# EAGLE design CPU_Dev_revB.2 (EAGLE 9.1.0)
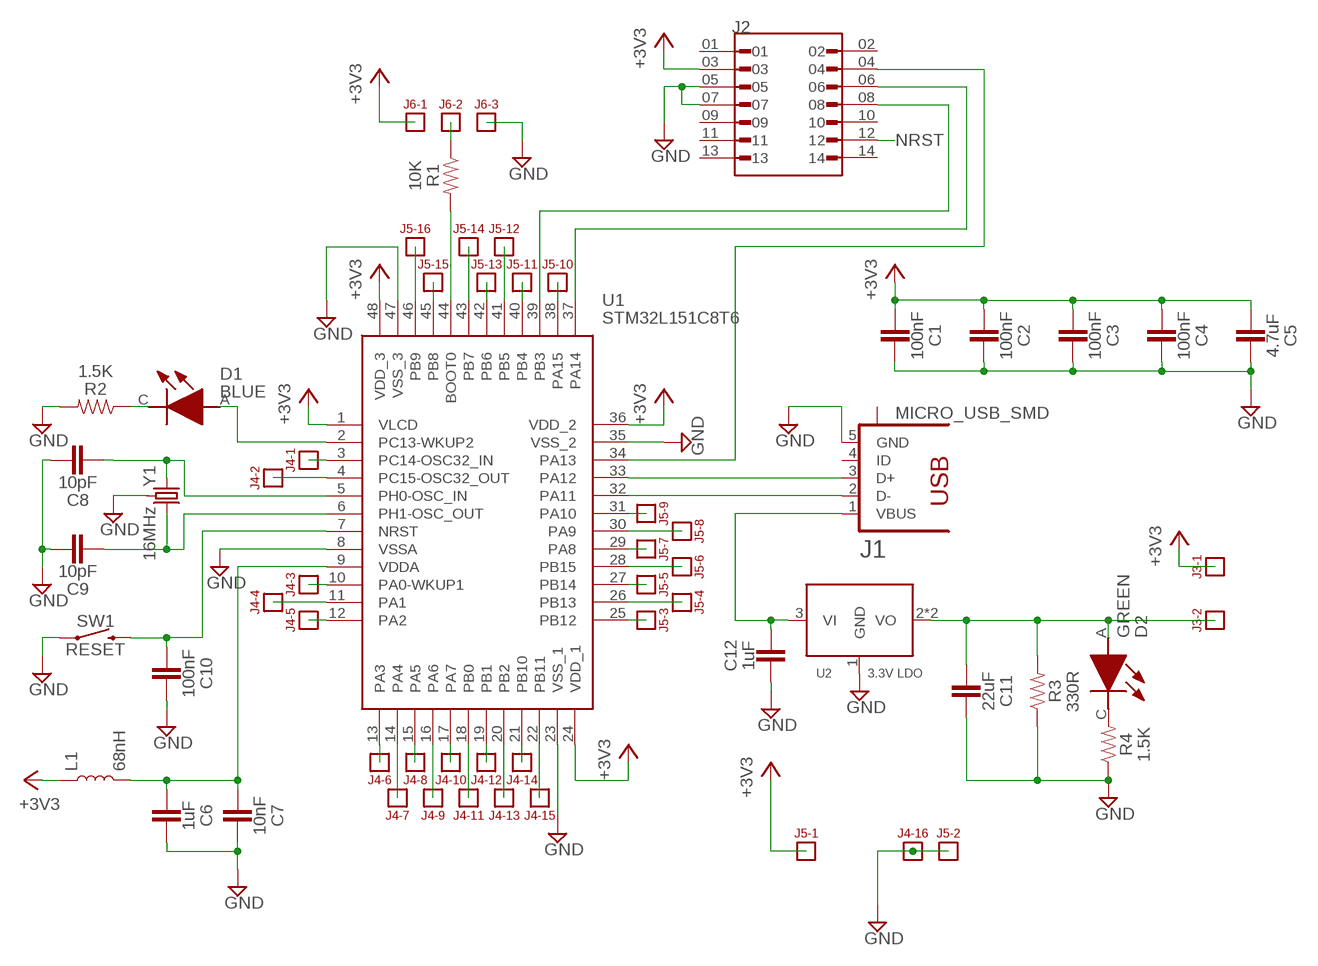
[diagram p0: schematic, sheet 1]

## Parts
C1  100nF  C_0402  [0402]
C2  100nF  C_0402  [0402]
C3  100nF  C_0402  [0402]
C4  100nF  C_0402  [0402]
C5  4.7uF  C_0402  [0402]
C6  1uF  C_0402  [0402]
C7  10nF  C_0402  [0402]
C8  10pF  C_0402  [0402]
C9  10pF  C_0402  [0402]
C10  100nF  C_0402  [0402]
C11  22uF  C_1206  [1206]
C12  1uF  C_0402  [0402]
D1  BLUE  LED_0603  [LED_0603]
D2  GREEN  LED_0603  [LED_0603]
J1  MICRO_USB_SMD  [10118192-0002LF]
J2  HEADER_DEBUG_SMD  [HEADER_DEBUG_SMD]
J3  HEADER_2PIN  [HEADER_2PIN]
J4  HEADER_16PIN  [HEADER_16PIN]
J5  HEADER_16PIN  [HEADER_16PIN]
J6  HEADER_3PIN  [HEADER_3PIN]
L1  68nH  L_0603  [0603]
R1  10K  R_0402  [0402]
R2  1.5K  R_0402  [0402]
R3  330R  R_0402  [0402]
R4  1.5K  R_0402  [0402]
SW1  RESET  PUSHBUTTON_SMD  [PUSHBUTTON_SMD]
U1  STM32L151C8T6  [LQFP-48_7X7]
U2  3.3V LDO  VREG_SOT223  [SOT223]
Y1  16MHz  XTAL_SMD3225-4P  [SMD3225-4P]

## Nets
+3V3: C1.1 C2.1 C3.1 C4.1 C5.1 J2.03 J3.P$1 J5.P$1 J6.P$1 L1.1 U1.1(VLCD) U1.24(VDD_1) U1.36(VDD_2) U1.48(VDD_3)
BOOT0: R1.2 U1.44(BOOT0)
GND: C1.2 C2.2 C3.2 C4.2 C5.2 C6.2 C7.2 C8.2 C9.2 C10.2 C11.2 C12.1 J1.5(GND) J2.05 J2.07 J4.P$16 J5.P$2 J6.P$3 R2.2 R3.1 R4.1 SW1.A1 SW1.B1 U1.8(VSSA) U1.23(VSS_1) U1.35(VSS_2) U1.47(VSS_3) U2.1(GND) Y1.2 Y1.4
N$1: C12.2 J1.1(VBUS) U2.3(VI)
N$2: C11.1 D2.A J3.P$2 R3.2 U2.2(VO) U2.4(VO)
N$4: D2.C(K) R4.2
N$8: D1.C(K) R2.1
N$9: J6.P$2 R1.1
NRST: C10.1 J2.12 SW1.C1 SW1.D1 U1.7(NRST)
PA0: J4.P$3 U1.10(PA0-WKUP1)
PA1: J4.P$4 U1.11(PA1)
PA2: J4.P$5 U1.12(PA2)
PA3: J4.P$6 U1.13(PA3)
PA4: J4.P$7 U1.14(PA4)
PA5: J4.P$8 U1.15(PA5)
PA6: J4.P$9 U1.16(PA6)
PA7: J4.P$10 U1.17(PA7)
PA8: J5.P$7 U1.29(PA8)
PA9: J5.P$8 U1.30(PA9)
PA10: J5.P$9 U1.31(PA10)
PA11: J1.2(D-) U1.32(PA11)
PA12: J1.3(D+) U1.33(PA12)
PA13: J2.04 U1.34(PA13)
PA14: J2.06 U1.37(PA14)
PA15: J5.P$10 U1.38(PA15)
PB0: J4.P$11 U1.18(PB0)
PB1: J4.P$12 U1.19(PB1)
PB2: J4.P$13 U1.20(PB2)
PB3: J2.08 U1.39(PB3)
PB4: J5.P$11 U1.40(PB4)
PB5: J5.P$12 U1.41(PB5)
PB6: J5.P$13 U1.42(PB6)
PB7: J5.P$14 U1.43(PB7)
PB8: J5.P$15 U1.45(PB8)
PB9: J5.P$16 U1.46(PB9)
PB10: J4.P$14 U1.21(PB10)
PB11: J4.P$15 U1.22(PB11)
PB12: J5.P$3 U1.25(PB12)
PB13: J5.P$4 U1.26(PB13)
PB14: J5.P$5 U1.27(PB14)
PB15: J5.P$6 U1.28(PB15)
PC14: J4.P$1 U1.3(PC14-OSC32_IN)
PC15: J4.P$2 U1.4(PC15-OSC32_OUT)
PH0: C8.1 U1.5(PH0-OSC_IN) Y1.1
PH1: C9.1 U1.6(PH1-OSC_OUT) Y1.3
VDDA: C6.1 C7.1 L1.2 U1.9(VDDA)
WKUP: D1.A U1.2(PC13-WKUP2)
Unconnected: J1.4(ID) J1.S1 J2.01 J2.02 J2.09 J2.10 J2.11 J2.13 J2.14

## Library data of the parts
C1-C10 C12 = NSE LABS:C_0402: Samsung Source: Datasheet <https://datasheet.lcsc.com/szlcsc/Samsung-Electro-Mechanics-CL05B104KB54PNC_C307331.pdf>
C11 = NSE LABS:C_1206
D1 D2 = NSE LABS:LED_0603
J1 = NSE LABS:MICRO_USB_SMD: Receptacle, micro-USB, type A/B Tyco Electronics
J2 = NSE LABS:HEADER_DEBUG_SMD
J3 = NSE LABS:HEADER_2PIN
J4 J5 = NSE LABS:HEADER_16PIN
J6 = NSE LABS:HEADER_3PIN
L1 = NSE LABS:L_0603
R1-R4 = NSE LABS:R_0402
SW1 = NSE LABS:PUSHBUTTON_SMD
U1 = NSE LABS:STM32L151C8T6: MCU 32-bit ARM Cortex M3 RISC 64KB Flash 2.5V/3.3V 48-Pin LQFP Tray Source: Datasheet <https://www.st.com/resource/en/datasheet/stm32l151c8.pdf>; ARROW_PART_NUMBER: STM32L151C8T6; ARROW_PRICE-STOCK: https://www.arrow.com/en/products/stm32l151c8t6/stmicroelectronics?region=nac; DESCRIPTION: MCU 32-bit ARM Cortex M3 RISC 64KB Flash 2.5V/3.3V 48-Pin LQFP Tray; HEIGHT: 1.6mm; MANUFACTURER_NAME: STMicroelectronics; MANUFACTURER_PART_NUMBER: STM32L151C8T6; MOUSER_PART_NUMBER: 511-STM32L151C8T6; MOUSER_PRICE-STOCK: https://www.mouser.co.uk/ProductDetail/STMicroelectronics/STM32L151C8T6?qs=G0rgft3hAxIeaXnyBBjaCA%3D%3D
U2 = NSE LABS:VREG_SOT223
Y1 = NSE LABS:XTAL_SMD3225-4P

## Board
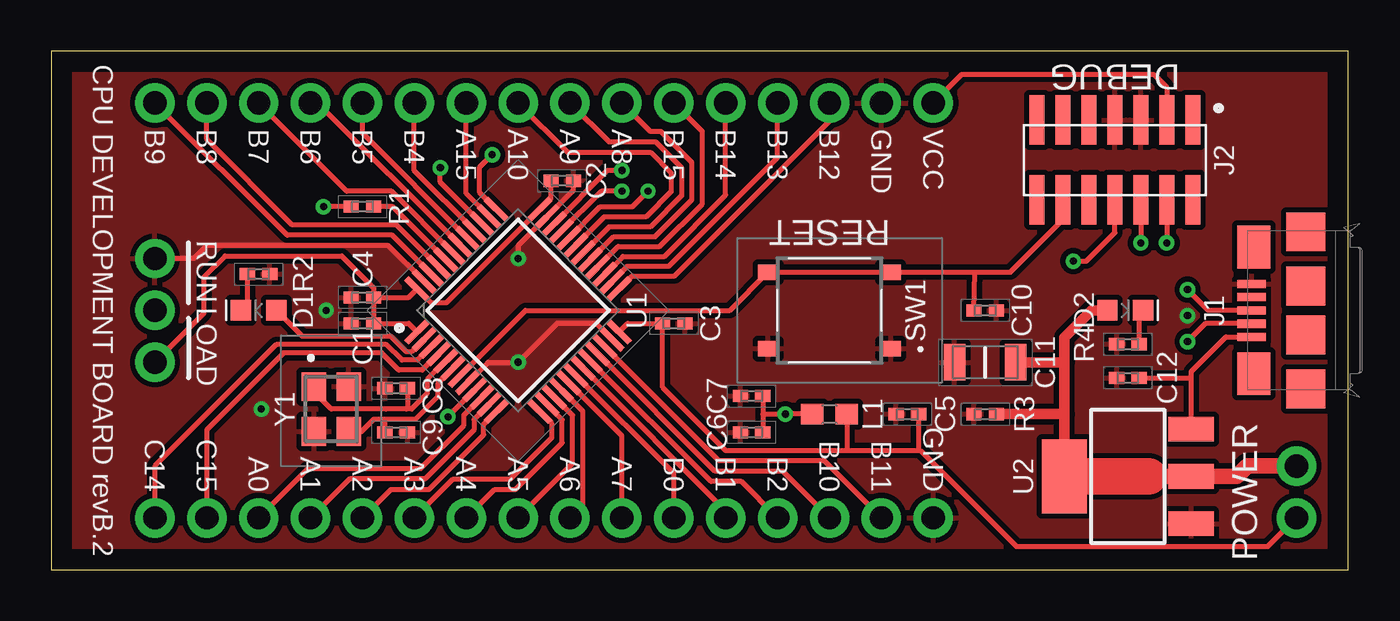
[diagram p1: board, top side]
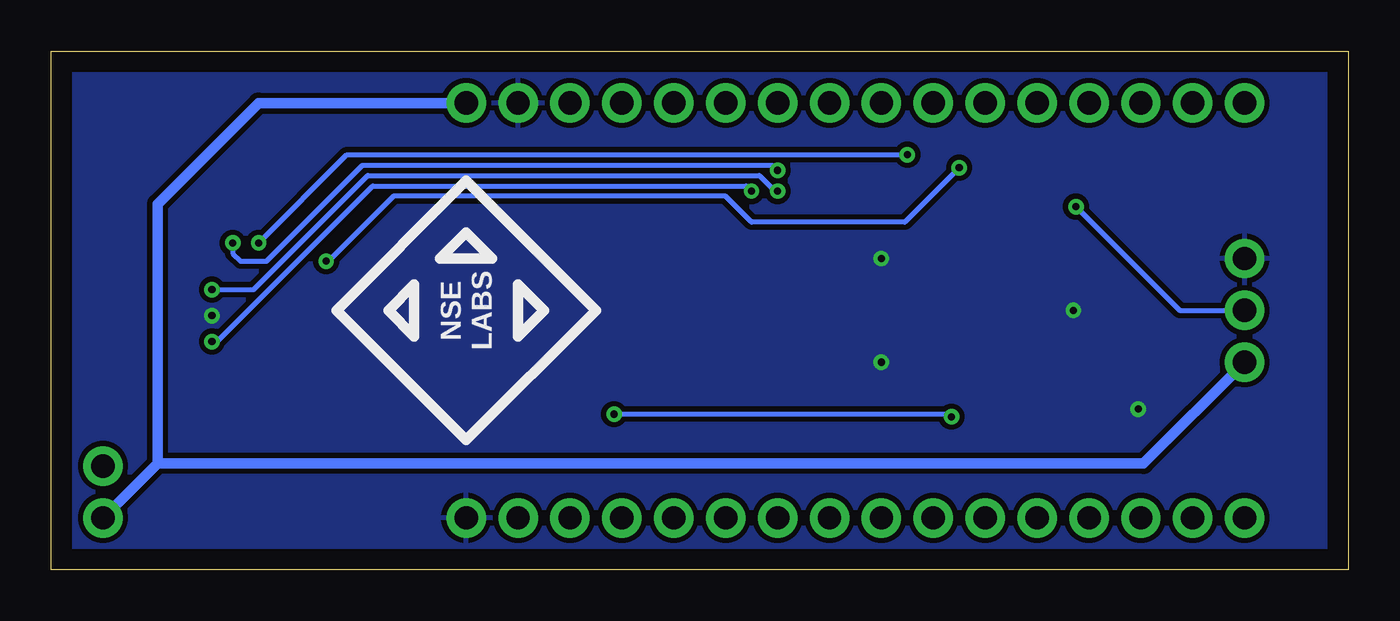
[diagram p2: board, bottom side, seen from below]

Size 63.5 x 25.4 mm. Coordinates in mm from the lower left corner, seen from the top.
Outline: 0,0 63.5,0 63.5,25.4 0,25.4 0,0
Copper layers (1*16): Top 0.035mm / dielectric 1.5mm / Bottom 0.035mm
Design rules "default": minimum track width 6mil, minimum drill 0.35mm, track to track 6mil, track to pad 6mil, pad to pad 6mil, via to via 6mil, smd to smd 6mil, copper to edge 40mil, drill to drill 6mil, minimum pad ring 10mil, minimum via ring 8mil, stop-mask expansion 4mil, vias tented up to drill 0mil, thermal gap 10mil

### Footprints (pad centres in the part's own frame; a part is rotated, then mirrored left to right if it is on the bottom)
0402 = smd 0.75 x 0.6: 1 -0.55,0; 2 0.55,0
1206 = smd 1.05 x 1.8: 1 -1.5,0; 2 1.5,0
LED_0603 = smd 1 x 1: A -0.877,0; C 0.877,0
10118192-0002LF = smd 0.4 x 1.4: 1 -1.3,1.2; 2 -0.65,1.2; 3 0,1.2; 4 0.65,1.2; 5 1.3,1.2 | smd 1.9 x 1.9: M1 -1.2,-1.45; M2 1.2,-1.45; S1 -3.85,-1.45; S2 3.85,-1.45 | smd 2.1 x 1.6: S3 -3.1,1.1; S4 3.1,1.1
HEADER_DEBUG_SMD = smd 0.737 x 2.413: 01 -3.81,-1.956; 02 -3.81,1.956; 03 -2.54,-1.956; 04 -2.54,1.956; 05 -1.27,-1.956; 06 -1.27,1.956; 07 0,-1.956; 08 0,1.956; 09 1.27,-1.956; 10 1.27,1.956; 11 2.54,-1.956; 12 2.54,1.956; 13 3.81,-1.956; 14 3.81,1.956
HEADER_2PIN = drill 1.143 pad 1.93: P$1 -1.27,0; P$2 1.27,0
HEADER_16PIN = drill 1.143 pad 1.93: P$1 -19.05,0; P$2 -16.51,0; P$3 -13.97,0; P$4 -11.43,0; P$5 -8.89,0; P$6 -6.35,0; P$7 -3.81,0; P$8 -1.27,0; P$9 1.27,0; P$10 3.81,0; P$11 6.35,0; P$12 8.89,0; P$13 11.43,0; P$14 13.97,0; P$15 16.51,0; P$16 19.05,0
HEADER_3PIN = drill 1.143 pad 1.93: P$1 -2.54,0; P$2 0,0; P$3 2.54,0
0603 = smd 1.1 x 1: 1 -0.85,0; 2 0.85,0
PUSHBUTTON_SMD = smd 1 x 0.75: A1 -3,1.875; B1 3,1.875; C1 -3,-1.875; D1 3,-1.875
LQFP-48_7X7 = smd 1.475 x 0.3: 1 -4.238,2.75; 2 -4.238,2.25; 3 -4.238,1.75; 4 -4.238,1.25; 5 -4.238,0.75; 6 -4.238,0.25; 7 -4.238,-0.25; 8 -4.238,-0.75; 9 -4.238,-1.25; 10 -4.238,-1.75; 11 -4.238,-2.25; 12 -4.238,-2.75; 25 4.238,-2.75; 26 4.238,-2.25; 27 4.238,-1.75; 28 4.238,-1.25; 29 4.238,-0.75; 30 4.238,-0.25; 31 4.238,0.25; 32 4.238,0.75; 33 4.238,1.25; 34 4.238,1.75; 35 4.238,2.25; 36 4.238,2.75 | smd 0.3 x 1.475: 13 -2.75,-4.238; 14 -2.25,-4.238; 15 -1.75,-4.238; 16 -1.25,-4.238; 17 -0.75,-4.238; 18 -0.25,-4.238; 19 0.25,-4.238; 20 0.75,-4.238; 21 1.25,-4.238; 22 1.75,-4.238; 23 2.25,-4.238; 24 2.75,-4.238; 37 2.75,4.238; 38 2.25,4.238; 39 1.75,4.238; 40 1.25,4.238; 41 0.75,4.238; 42 0.25,4.238; 43 -0.25,4.238; 44 -0.75,4.238; 45 -1.25,4.238; 46 -1.75,4.238; 47 -2.25,4.238; 48 -2.75,4.238
SOT223 = smd 1.219 x 2.235: 1 -2.311,-3.099; 2 0,-3.099; 3 2.311,-3.099 | smd 3.6 x 2.2: 4 0,3.099
SMD3225-4P = smd 1.4 x 1.2: 1 -1.1,-0.85; 2 1.1,-0.85; 3 1.1,0.85; 4 -1.1,0.85

### Placement (x,y rotation side)
C1  15.24,12.06 180 top
C2  25.02,19.05 0 top
C3  30.48,12.06 0 top
C4  15.24,13.34 180 top
C5  41.91,7.62 180 top
C6  34.29,6.73 180 top
C7  34.29,8.51 180 top
C8  16.89,8.89 180 top
C9  16.89,6.73 0 top
C10  45.72,12.7 0 top
C11  45.72,10.16 180 top
C12  52.7,9.4 0 top
D1  10.16,12.7 180 top
D2  52.58,12.7 0 top
J1  59.97,12.7 90 top
J2  52.07,20.07 180 top
J3  60.96,3.81 90 top
J4  24.13,2.54 0 top
J5  24.13,22.86 180 top
J6  5.08,12.7 90 top
L1  38.1,7.62 180 top
R1  15.24,17.78 0 top
R2  10.16,14.48 0 top
R3  45.72,7.62 0 top
R4  52.7,11.05 0 top
SW1  38.1,12.7 180 top
U1  22.86,12.7 45 top
U2  52.7,4.57 90 top
Y1  13.72,7.87 270 top

### Tracks (layer width: path | path; a pad name or v marks a point on that pad's centre or on a via)
+3V3
  Top 0.254: J5.P$1 44.58,24.26 53.98,24.26 54.61,23.62 J2.03 | J3.P$1 59.56,1.14 47.24,1.14 42.55,5.84 42.42,5.84 | C4.1 17.5,13.34 U1.48 18.59,13.08 19.35,13.08 U1.36 23.95,17.64 24.47,18.16 C2.1 | U1.1 17.5,12.06 C1.1 C4.1 | U1.24 28.22,12.06 C3.1 29.93,8.93 33.02,5.84 38.99,5.84 | C4.1 15.79,13.8 14.22,15.37 8.51,15.37 7.49,14.35 7.49,12.57 J6.P$1 | 38.99,5.84 42.42,5.84 | L1.1 38.95,5.88 38.99,5.84 | C5.1 42.46,5.88 42.42,5.84
  Bottom 0.508: J6.P$1 10.03,5.21 58.29,5.21 | 58.29,5.21 J3.P$1 | 58.29,5.21 58.29,17.91 53.34,22.86 J5.P$1
BOOT0
  Top 0.254: U1.44 16.72,17.78 R1.2
GND  (via drill 0.35)
  Top 0.254: U1.8 21.38,10.16 v22.86,10.16 24.77,12.06 26.68,12.06 U1.23 | v22.86,15.24 22.86,15.88 U1.35 25.57,18.59 C2.2 | U1.47 16.5,15.88 7.62,15.88 6.99,15.24 J6.P$3
  other vias: 55.63,12.45 13.46,12.7 10.29,7.87
  pour Top (isolate 0.254): 0,0 63.5,0 63.5,25.4 0,25.4
  pour Bottom (isolate 0.254): 0,0 63.5,0 63.5,25.4 0,25.4
N$1
  Top 0.254: U2.3 55.8,9.4 | 55.8,9.4 55.8,9.7 57.5,11.4 J1.1 | C12.2 55.8,9.4
N$2
  Top 0.508: U2.4 49.61,7.62 | 49.61,7.62 49.61,10.16 | 49.61,10.16 49.61,11.38 50.93,12.7 D2.A | C11.1 49.61,10.16 | R3.2 49.61,7.62
  Top 0.762: J3.P$2 58.55,5.08 58.04,4.57 U2.2 53.72,4.57
  Top 1.778: U2.4 53.72,4.57
N$4
  Top 0.254: R4.2 53.26,12.5 D2.C
N$8
  Top 0.254: R2.1 9.61,13.03 D1.C
N$9  (via drill 0.35)
  Top 0.254: R1.1 v13.34,17.78
  Bottom 0.254: v13.34,17.78 8.26,12.7 J6.P$2
NRST
  Top 0.254: U1.7 23.21,12.7 33.23,12.7 SW1.D1 SW1.C1 44.45,14.57 45.21,14.57 | 45.21,14.57 46.96,14.57 49.53,17.14 J2.12 | C10.1 45.21,14.57
PA0
  Top 0.254: J4.P$3 12.57,4.95 18.1,4.95 20.21,7.07 20.21,7.58 U1.10
PA1
  Top 0.254: J4.P$4 14.61,4.45 18.3,4.45 20.69,6.84 20.69,7.35 U1.11
PA2
  Top 0.254: J4.P$5 16.64,3.94 18.49,3.94 21.17,6.62 21.17,7.12 U1.12
PA3
  Top 0.254: J4.P$6 19.68,4.45 22.48,4.45 24.51,6.48 24.51,7.16 U1.13
PA4
  Top 0.254: J4.P$7 21.72,3.94 22.73,3.94 25.02,6.22 25.02,7.36 U1.14
PA5
  Top 0.254: J4.P$8 25.53,5.21 25.53,7.56 U1.15
PA6
  Top 0.254: J4.P$9 26.04,3.17 26.04,7.76 U1.16
PA7
  Top 0.254: J4.P$10 27.94,6.56 U1.17
PA8
  Top 0.254: U1.29 27.53,16.31 29.56,16.31 31.37,18.12 31.37,19.94 29.84,21.46 29.34,21.46 J5.P$7
PA9
  Top 0.254: J5.P$8 27.3,20.95 29.59,20.95 30.86,19.68 30.86,18.32 29.34,16.79 27.3,16.79 U1.30
PA10
  Top 0.254: J5.P$9 25.27,20.45 29.34,20.45 30.35,19.43 30.35,18.52 29.11,17.27 27.08,17.27 U1.31
PA11  (via drill 0.35)
  Top 0.254: U1.32 26.87,17.77 28.45,17.77 v29.22,18.54 | J1.2 56.5,12.05 v55.63,11.18
  Bottom 0.254: v29.22,18.54 29.48,18.8 47.75,18.8 55.37,11.18 v55.63,11.18
PA12  (via drill 0.35)
  Top 0.254: U1.33 26.93,18.54 v27.94,18.54 | J1.3 56.64,12.7 v55.63,13.72 | v27.94,18.54
  Bottom 0.254: v55.63,13.72 53.59,13.72 48.01,19.3 28.83,19.3 28.07,18.54 v27.94,18.54
PA13  (via drill 0.35)
  Top 0.254: U1.34 27.24,19.56 v27.94,19.56 | J2.04 v54.61,16
  Bottom 0.254: v27.94,19.56 28.19,19.81 48.26,19.81 52.96,15.11 54.23,15.11 54.61,15.49 v54.61,16
PA14  (via drill 0.35)
  Top 0.254: v21.59,20.32 20.95,19.68 20.95,18.49 U1.37 | J2.06 v53.34,16
  Bottom 0.254: v21.59,20.32 49.02,20.32 v53.34,16
PA15
  Top 0.254: U1.38 20.32,18.42 J5.P$10
PB0
  Top 0.254: J4.P$11 30.48,4.73 U1.18
PB1
  Top 0.254: J4.P$12 33.02,2.89 U1.19
PB2
  Top 0.254: J4.P$13 33.78,4.32 32.3,4.32 U1.20
PB3  (via drill 0.35)
  Top 0.254: U1.39 19.05,18.98 v19.05,19.68 | v50.04,15.11 50.67,15.11 52.07,16.51 J2.08
  Bottom 0.254: v19.05,19.68 21.72,17.02 29.21,17.02 30.48,18.29 46.74,18.29 49.91,15.11 v50.04,15.11
PB4
  Top 0.254: U1.40 17.78,19.55 J5.P$11
PB5
  Top 0.254: U1.41 15.24,21.38 J5.P$12
PB6
  Top 0.254: U1.42 13.05,22.86 J5.P$13
PB7
  Top 0.254: U1.43 16.66,18.54 14.48,18.54 J5.P$14
PB8
  Top 0.254: U1.45 16.9,16.89 11.81,16.89 7.62,21.08 J5.P$15
PB9
  Top 0.254: U1.46 16.7,16.38 11.56,16.38 J5.P$16
PB10
  Top 0.254: J4.P$14 35.81,4.83 32.5,4.83 U1.21
PB11
  Top 0.254: J4.P$15 37.85,5.33 32.7,5.33 U1.22
PB12
  Top 0.254: U1.25 28.44,14.39 30.52,14.39 38.1,21.97 J5.P$3
PB13
  Top 0.254: J5.P$4 35.56,20.19 30.24,14.87 28.21,14.87 U1.26
PB14
  Top 0.254: J5.P$5 33.02,18.35 30.02,15.35 27.98,15.35 U1.27
PB15
  Top 0.254: U1.28 27.76,15.83 29.79,15.83 31.88,17.92 31.88,21.46 J5.P$6
PC14
  Top 0.254: U1.3 17.95,10.26 17.17,10.26 16.41,11.02 11.02,11.02 5.08,5.08 J4.P$1
PC15
  Top 0.254: U1.4 18.17,9.78 17.02,9.78 16.18,10.62 11.38,10.62 7.62,6.86 J4.P$2
PH0
  Top 0.254: U1.5 18.41,9.32 18.41,8.64 17.65,7.87 17.4,7.87 | 17.4,7.87 16.38,7.87 13.71,7.87 12.87,8.72 Y1.1 | C8.1 17.44,7.92 17.4,7.87
PH1
  Top 0.254: 16.38,7.37 17.81,7.37 18.93,8.48 18.93,9.12 U1.6 | 16.38,7.37 15.79,7.37 15.2,6.77 Y1.3 | C9.1 16.34,7.32 16.38,7.37
VDDA  (via drill 0.35)
  Top 0.254: L1.2 v35.94,7.62 34.84,7.62 | v19.43,7.49 19.43,7.5 U1.9 | C7.1 34.84,7.62 | 34.84,7.62 C6.1
  Bottom 0.254: v35.94,7.62 19.56,7.62 v19.43,7.49
WKUP
  Top 0.254: U1.2 17.65,10.67 17.4,10.67 16.64,11.43 12.31,11.43 D1.A

### Text on the board
tPlace: DEBUG | B9 | B8 | B7 | B6 | B5 | B4 | A15 | A10 | A9 | A8 | B15 | B14 | B13 | B12 | GND | VCC | RESET | RUN | CPU DEVELOPMENT BOARD revB.2 | LOAD | C14 | C15 | A0 | A1 | A2 | A3 | A4 | A5 | A6 | A7 | B0 | B1 | B2 | B10 | B11 | GND | POWER
bPlace: NSE / LABS